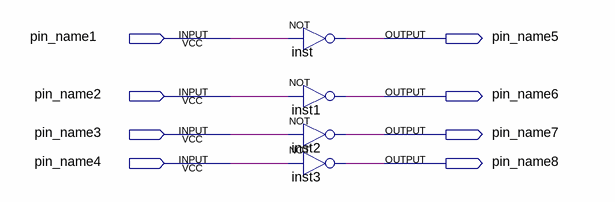
[diagram p0: schematic sheet]
// Quartus schematic try.bdf as structural Verilog: 4 symbols, 8 pins
module try (
  input  pin_name1,
  input  pin_name2,
  input  pin_name3,
  input  pin_name4,
  output pin_name5,
  output pin_name6,
  output pin_name7,
  output pin_name8
);

  not inst (pin_name5, pin_name1);
  not inst1 (pin_name6, pin_name2);
  not inst2 (pin_name7, pin_name3);
  not inst3 (pin_name8, pin_name4);
endmodule
